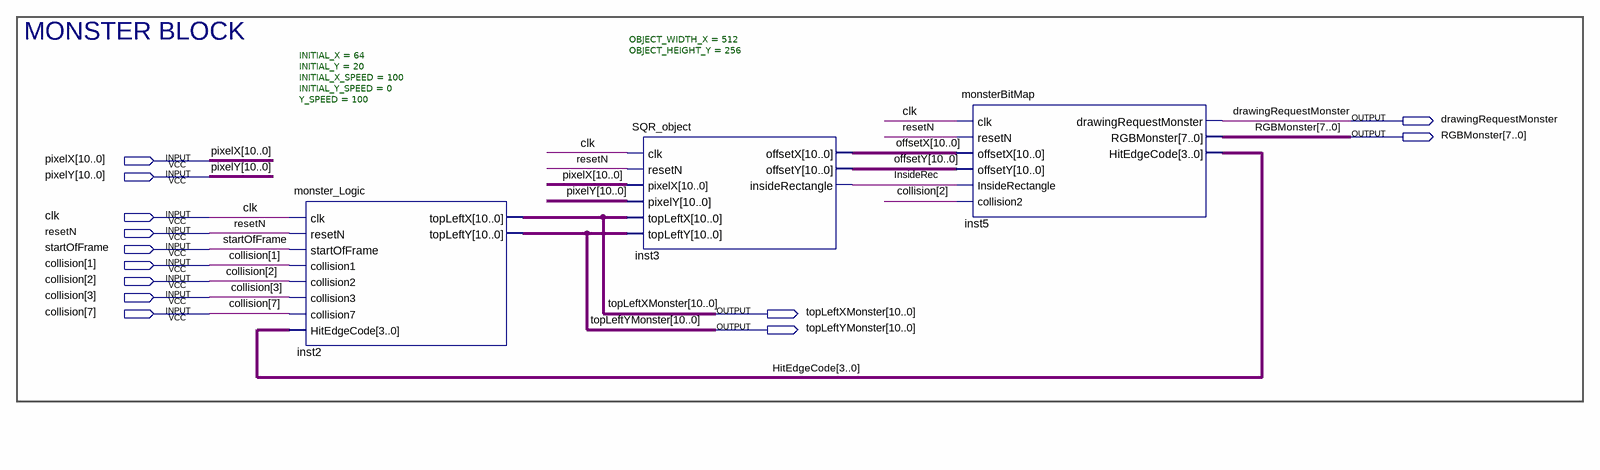
[diagram p0: schematic sheet]
// Quartus schematic Monster_Block.bdf as structural Verilog: 3 symbols, 13 pins
module Monster_Block (
  input  [10:0] pixelX,
  input  [10:0] pixelY,
  input  clk,
  input  resetN,
  input  startOfFrame,
  input  [7:1] collision,
  output drawingRequestMonster,
  output [7:0] RGBMonster,
  output [10:0] topLeftXMonster,
  output [10:0] topLeftYMonster
);

  wire InsideRec;
  wire [3:0] HitEdgeCode;
  wire [10:0] offsetX, offsetY;

  monster_Logic #(.INITIAL_X(64), .INITIAL_Y(20), .INITIAL_X_SPEED(100), .INITIAL_Y_SPEED(0), .Y_SPEED(100)) inst2 (
    .clk(clk), .resetN(resetN), .startOfFrame(startOfFrame), .collision1(collision[1]),
    .collision2(collision[2]), .collision3(collision[3]), .collision7(collision[7]),
    .HitEdgeCode(HitEdgeCode), .topLeftX(topLeftXMonster), .topLeftY(topLeftYMonster));
  SQR_object #(.OBJECT_WIDTH_X(512), .OBJECT_HEIGHT_Y(256)) inst3 (
    .clk(clk), .resetN(resetN), .pixelX(pixelX), .pixelY(pixelY), .topLeftX(topLeftXMonster),
    .topLeftY(topLeftYMonster), .offsetX(offsetX), .offsetY(offsetY), .insideRectangle(InsideRec));
  monsterBitMap inst5 (
    .clk(clk), .resetN(resetN), .offsetX(offsetX), .offsetY(offsetY), .InsideRectangle(InsideRec),
    .collision2(collision[2]), .drawingRequestMonster(drawingRequestMonster), .RGBMonster(RGBMonster),
    .HitEdgeCode(HitEdgeCode));

  // Notes on the sheet:
  //   MONSTER BLOCK
endmodule
